# EasyEDA Pro project ProPrj_AD母版_2026-01-14.epro

# Schematic Sheet1
Board Name: Sheet1; Create Date: 2025-06-05; Page Name: Sheet1; Project Name: AD母版; Schematic Name: Sheet1; Update Date: 2025-06-05
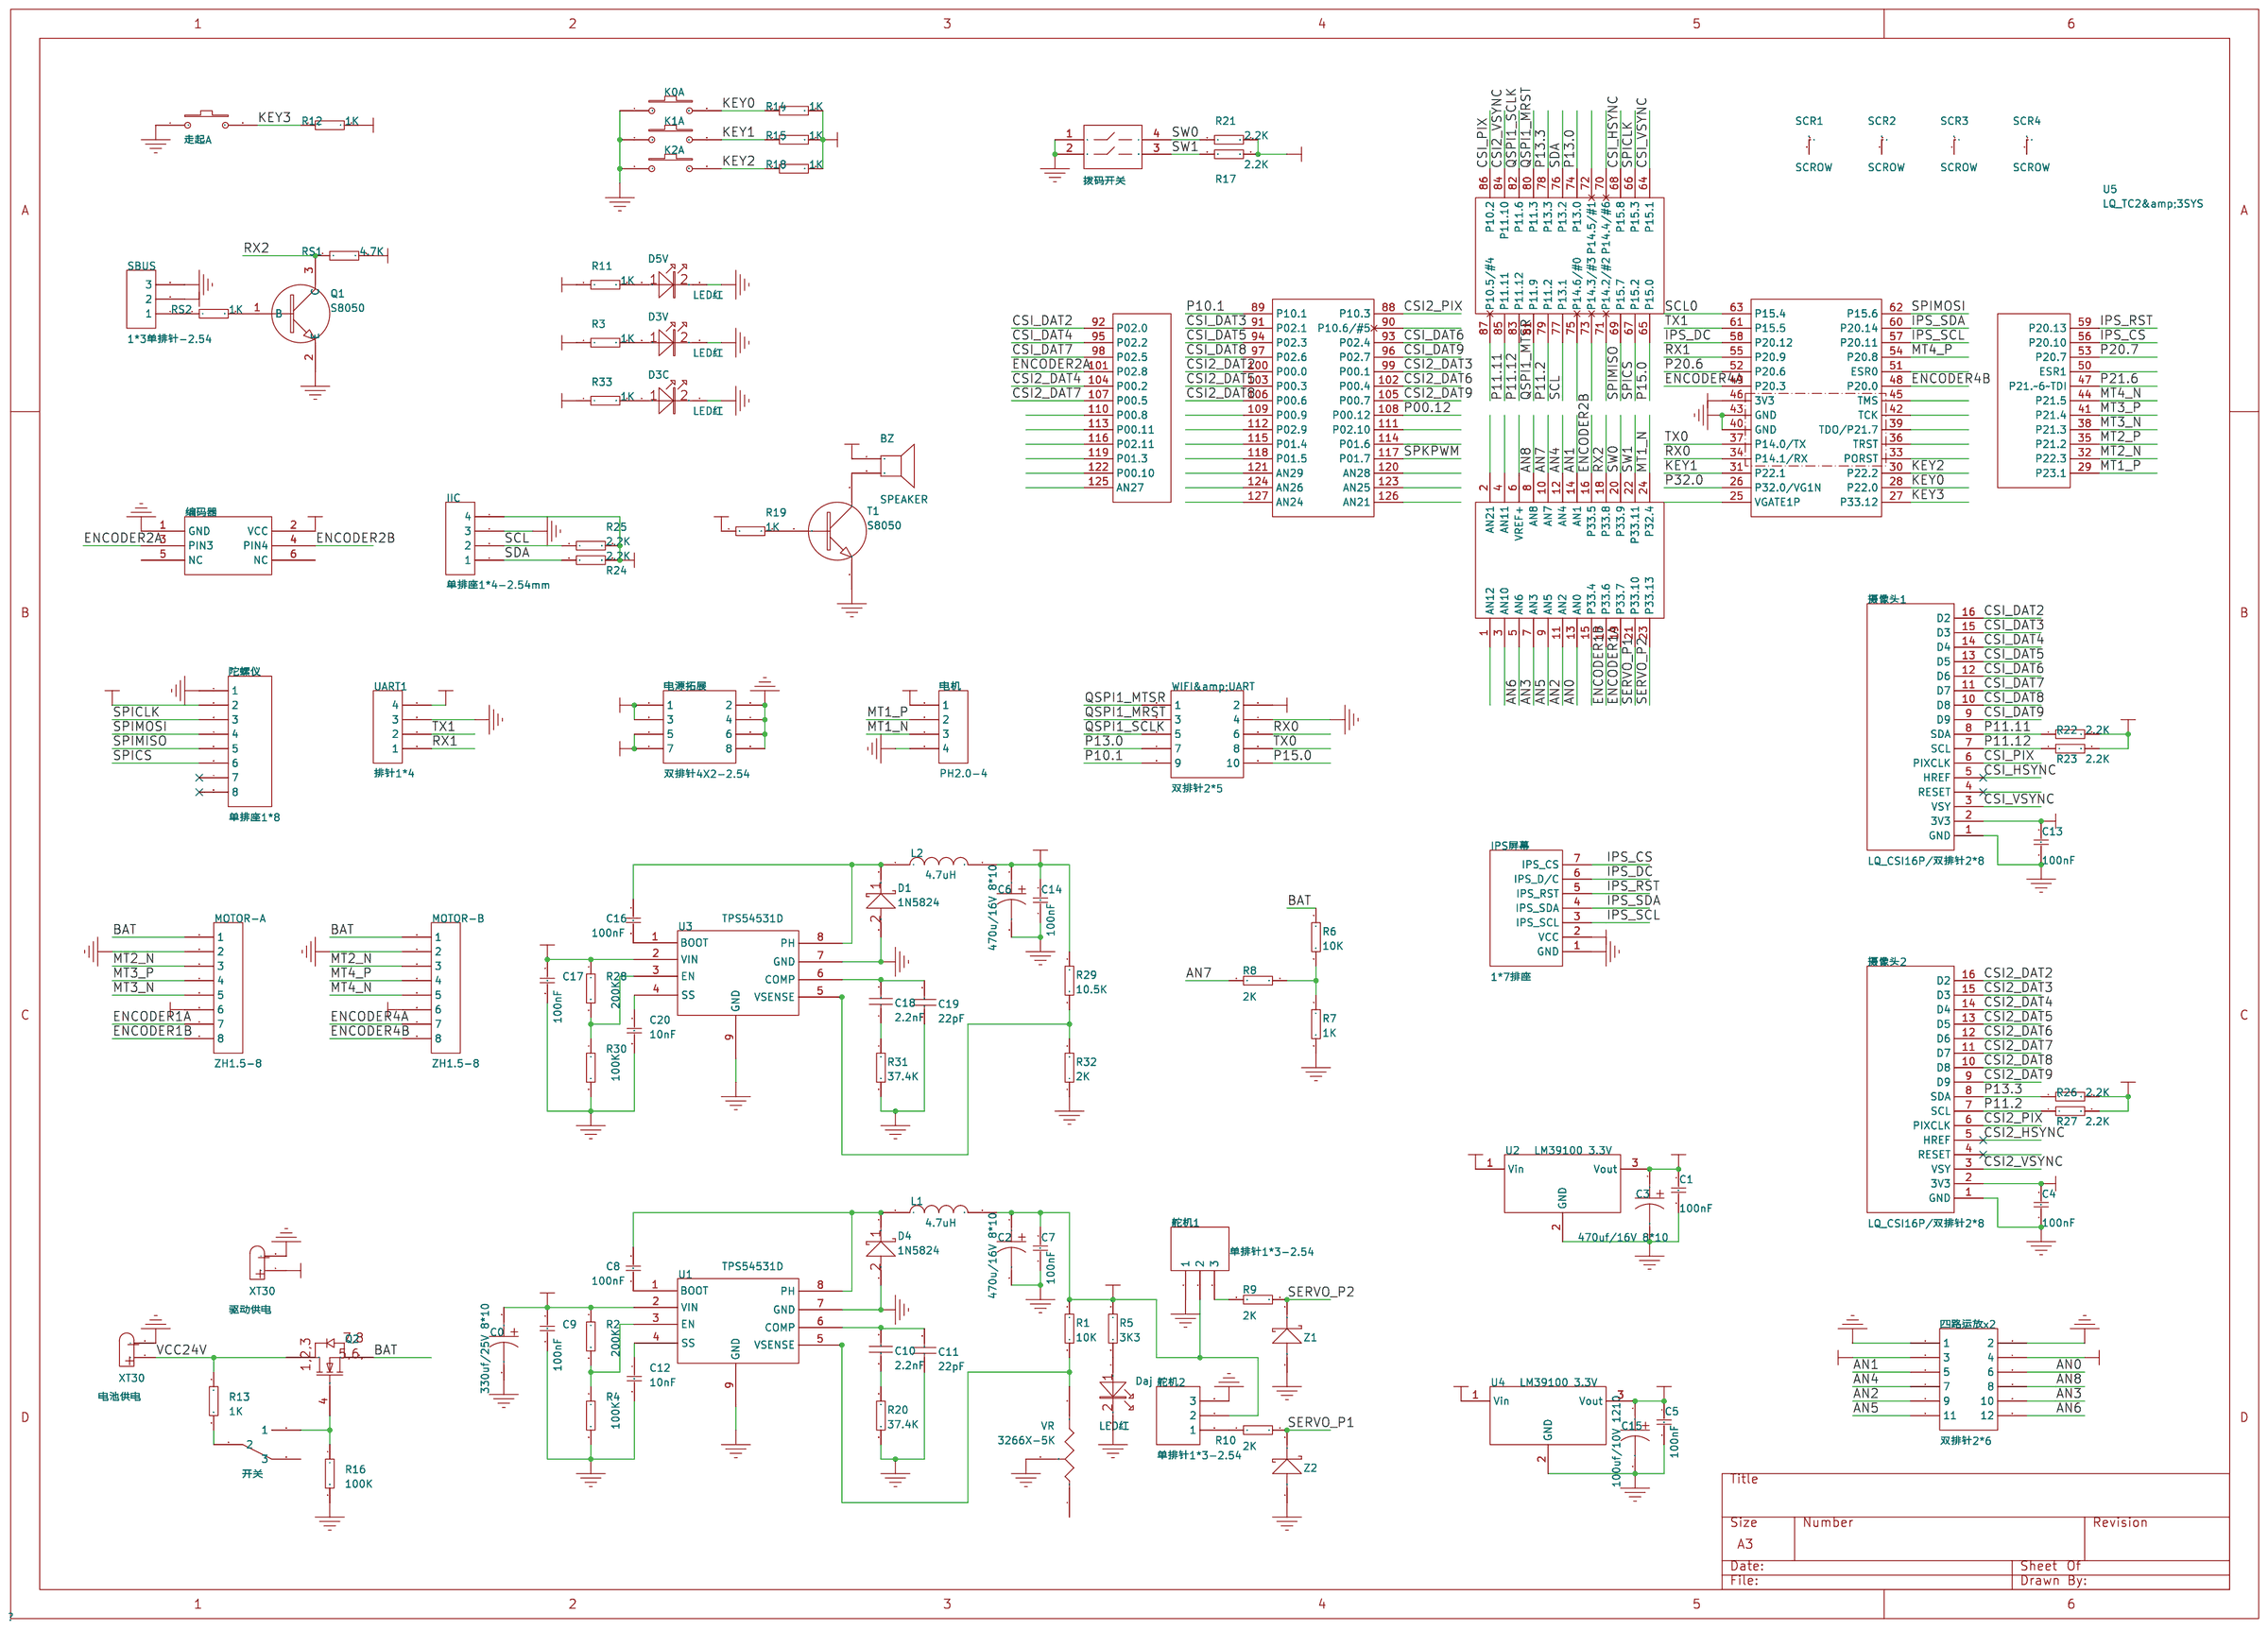
[diagram p0: schematic sheet]

## Parts
BZ  SPEAKER  [LQ_BUZZER9]
C0  330uf/25V 8*10  [LQ_C8X10]
C1  100nF  [LQ_C0603]
C2  470u/16V 8*10  [LQ_C8X10]
C3  470uf/16V 8*10  [LQ_C8X10]
C4  100nF  [LQ_C0603]
C5  100nF  [LQ_C0603]
C6  470u/16V 8*10  [LQ_C8X10]
C7  100nF  [LQ_C0603]
C8  100nF  [LQ_C0603]
C9  100nF  [LQ_C0603]
C10  2200pF  [LQ_C0603]
C11  2200pF  [LQ_C0603]
C12  10nF  [LQ_C0603]
C13  100nF  [LQ_C0603]
C14  100nF  [LQ_C0603]
C15  100uf/10V 1210  [LQ_C1210T]
C16  100nF  [LQ_C0603]
C17  100nF  [LQ_C0603]
C18  2200pF  [LQ_C0603]
C19  2200pF  [LQ_C0603]
C20  10nF  [LQ_C0603]
D1  1N5824  [LQ_D1812Z]
D3C  LED红  [LQ_LED0603R]
D3V  LED红  [LQ_LED0603R]
D4  1N5824  [LQ_D1812Z]
D5V  LED红  [LQ_LED0603R]
Daj  LED红  [LQ_LED0603R]
IIC  单排座1*4-2.54mm  [LQ_SIP4]
IPS屏幕  1*7排座  [LQ_SIP7]
K0  微动开关6*6*6  [LQ_BT4SMT]  (section 1)
K1  微动开关6*6*6  [LQ_BT4SMT]  (section 1)
K2  微动开关6*6*6  [LQ_BT4SMT]  (section 1)
L1  4.7uH  [LQ_L7X7]
L2  4.7uH  [LQ_L7X7]
MOTOR-A  ZH1.5-8  [ZH1.5-LI-8P]
MOTOR-B  ZH1.5-8  [ZH1.5-LI-8P]
Q1  S8050  [LQ_SOT-23NPN]
Q2  60V  [TRANS_NexFET_Q5B]
R1  10K  [LQ_R0603]
R2  200K  [LQ_R0603]
R3  1K  [LQ_R0603]
R4  100K  [LQ_R0603]
R5  3K3  [LQ_R0603]
R6  10K  [LQ_R0603]
R7  1K  [LQ_R0603]
R8  2K  [LQ_R0603]
R9  2K  [LQ_R0603]
R10  2K  [LQ_R0603]
R11  1K  [LQ_R0603]
R12  1K  [LQ_R0603]
R13  1K  [LQ_R0603]
R14  1K  [LQ_R0603]
R15  1K  [LQ_R0603]
R16  100K  [LQ_R0603]
R17  2.2K  [LQ_R0603]
R18  1K  [LQ_R0603]
R19  1K  [LQ_R0603]
R20  37.4K  [LQ_R0603]
R21  2.2K  [LQ_R0603]
R22  2.2K  [LQ_R0603]
R23  2.2K  [LQ_R0603]
R24  2.2K  [LQ_R0603]
R25  2.2K  [LQ_R0603]
R26  2.2K  [LQ_R0603]
R27  2.2K  [LQ_R0603]
R28  200K  [LQ_R0603]
R29  10.5K  [LQ_R0603]
R30  100K  [LQ_R0603]
R31  37.4K  [LQ_R0603]
R32  2K  [LQ_R0603]
R33  1K  [LQ_R0603]
RS1  4.7K  [LQ_R0603]
RS2  1K  [LQ_R0603]
SBUS  1*3单排针-2.54  [LQ_SIP3]
SCR1  SCROW  [LQ_SCROW3&5mm-N]
SCR2  SCROW  [LQ_SCROW3&5mm-N]
SCR3  SCROW  [LQ_SCROW3&5mm-N]
SCR4  SCROW  [LQ_SCROW3&5mm-N]
T1  S8050  [LQ_SOT-23NPN]
U1  TPS54531D  [LQ_SOP8S-p]
U2  LM39100 3.3V  [LQ_SOT-223]
U3  TPS54531D  [LQ_SOP8S-p]
U4  LM39100 3.3V  [LQ_SOT-223]
U5  LQ_TC2&amp;3SYS  [LQ_TC2&3SYS]
UART1  排针1*4  [LQ_SIP4]
VR  3266X-5K  [lq_3266]
WIFI&amp;UART  双排针2*5  [HDR2X5]
Z1  ZMM3V3  [LQ_D0805Z]
Z2  ZMM3V3  [LQ_D0805Z]
四路运放x2  双排针2*6  [HDR2X6]
开关  SS12D10  [LQ_SS12D10]
拨码开关  SW-DIP2  [DIP4]
摄像头1  LQ_CSI16P/双排针2*8  [LQ_IDC8X2]
摄像头2  LQ_CSI16P/双排针2*8  [LQ_IDC8X2]
电机  PH2.0-4  [LQ_SIP4]
电池供电  XT30  [LQ_XT30UPB-F]
电源拓展  双排针4X2-2.54  [LQ_IDC4X2]
编码器  双排针3X2  [LQ_ENCODER]
舵机1  单排针1*3-2.54  [LQ_SIP3]
舵机2  单排针1*3-2.54  [LQ_SIP3]
走起  微动开关6*6*6  [LQ_BT4SMT]  (section 1)
陀螺仪  单排座1*8  [LQ_IMU]
驱动供电  XT30  [LQ_XT30UPB-F]

## Library data of the parts
BZ = SPEAKER: Library Name: LQ-TCsUnicycleMBV2
C0 = 330uf/25V 8*10: Capacitor; Origin Footprint 2: LQ_C10X10; Design Item ID: CAPACITOR POL; Library Name: LQ-TCsUnicycleMBV2
C1 C4 C5 C7-C9 C13 C14 C16 C17 = 100nF: CAP; Origin Footprint 2: LQ_0805; Origin Footprint 3: LQ_0603; Origin Footprint 4: LQ_1206; Origin Footprint 5: LQ_1210; Design Item ID: LQ_CAP; Library Name: LQ-TCsUnicycleMBV2
C2 C6 = 470u/16V 8*10: Capacitor; Origin Footprint 2: LQ_C10X10; Design Item ID: CAPACITOR POL; Library Name: LQ-TCsUnicycleMBV2
C3 = 470uf/16V 8*10: Capacitor; Origin Footprint 2: LQ_C10X10; Design Item ID: CAPACITOR POL; Library Name: LQ-TCsUnicycleMBV2
C10 C18 = 2.2nF: Capacitor; Published: 8-Jun-2000; LatestRevisionDate: 17-Jul-2002; LatestRevisionNote: Re-released for DXP Platform.; PackageReference: RAD-0.3; Publisher: Altium Limited; PackageDescription: Radial Cap, Thru-Hole; 2 Leads; 0.3 in Pin Spacing; Origin Footprint 2: RAD-0.3; Origin Footprint 3: LQ_0603; Origin Footprint 4: 0603; Design Item ID: Cap; Library Name: LQ-TCsUnicycleMBV2
C11 C19 = 22pF: Capacitor; Published: 8-Jun-2000; LatestRevisionDate: 17-Jul-2002; LatestRevisionNote: Re-released for DXP Platform.; PackageReference: RAD-0.3; Publisher: Altium Limited; PackageDescription: Radial Cap, Thru-Hole; 2 Leads; 0.3 in Pin Spacing; Origin Footprint 2: RAD-0.3; Origin Footprint 3: LQ_0603; Origin Footprint 4: 0603; Design Item ID: Cap; Library Name: LQ-TCsUnicycleMBV2
C12 C20 = 10nF: CAP; Origin Footprint 2: LQ_0805; Origin Footprint 3: LQ_0603; Origin Footprint 4: LQ_1206; Origin Footprint 5: LQ_1210; Design Item ID: LQ_CAP; Library Name: LQ-TCsUnicycleMBV2
C15 = 100uf/10V 1210: Capacitor; Origin Footprint 2: LQ_C10X10; Design Item ID: CAPACITOR POL; Library Name: LQ-TCsUnicycleMBV2
D1 D4 = 1N5824: Schottky Diode; Origin Footprint 2: LQ_D1206Z; Origin Footprint 3: LQ_1210D; Origin Footprint 4: LQ_SOD-523; Design Item ID: LQ_Z; Library Name: LQ-TCsUnicycleMBV2
D3C D3V D5V Daj = LED红: Origin Footprint 2: LQ_LED0603RN; Origin Footprint 3: D1812; Design Item ID: LQ_LED; Library Name: LQ-TCsUnicycleMBV2
IIC = 单排座1*4-2.54mm: Connector; Design Item ID: CON4; Library Name: LQ-TCsUnicycleMBV2
IPS屏幕 = 1*7排座: Design Item ID: LQ_IPS; Library Name: LQ-TCsUnicycleMBV2
K0-K2 走起 = 微动开关6*6*6: Design Item ID: 微动开关; Library Name: LQ-TCsUnicycleMBV2
L1 L2 = 4.7uH: Design Item ID: INDUCTOR; Library Name: LQ-TCsUnicycleMBV2
MOTOR-A MOTOR-B = ZH1.5-8: Connector; Design Item ID: CON8; Library Name: LQ-TCsUnicycleMBV2
Q1 = S8050: NPN Transistor; Design Item ID: LQ_NPN; Library Name: LQ-TCsUnicycleMBV2
Q2 = AGM30P110A: 1个P沟道 耐压:30V 电流:138A，PDFN-8(5x6)。; SymbolVersion: 2008-07-09; CompType: MOSFET; PartNumber: CSD18532Q5B; Manufacturer: Texas Instruments; PackageReference: SON 5x6mm; U/M: EA; ChType: N; VdsMax_V: 60; Value1: 3.3 ohm; Rdson45_Ohm: 3.3; Value2: 27 nC; QgTyp_nC: 27; Vgs_V: 1.6; IdsMax_A: 172; RoHS: Y; MountType: SMT; Published: 2008-06-19; Publisher: Texas Instruments; LatestRevisionDate: 2014-05-23; LatestRevisionNote: Added parts.; ComponentLink1Description: Datasheet link; ComponentLink1URL: http://www.ti.com/lit/gpn/csd18532q5b; Alternate Manufacturer: None; Supplier 1: Digi-Key; Supplier Part Number 1: 296-35628-1-ND; Supplier 2: Mouser; Supplier Part Number 2: 595-CSD18532Q5B; Supplier 3: Newark; Supplier Part Number 3: 63W5308; Design Item ID: LQ_PMOS-DFN5X6; Library Name: LQ-TCsUnicycleMBV2
R1 R6 = 10K: RES; Origin Footprint 2: LQ_0805; Origin Footprint 3: 0603; Design Item ID: LQ_RES; Library Name: LQ-TCsUnicycleMBV2
R2 R28 = 200K: RES; Origin Footprint 2: LQ_0805; Origin Footprint 3: 0603; Design Item ID: LQ_RES; Library Name: LQ-TCsUnicycleMBV2
R3 R7 R11-R15 R18 R19 R33 RS2 = 1K: RES; Origin Footprint 2: LQ_0805; Origin Footprint 3: 0603; Design Item ID: LQ_RES; Library Name: LQ-TCsUnicycleMBV2
R4 R16 R30 = 100K: RES; Origin Footprint 2: LQ_0805; Origin Footprint 3: 0603; Design Item ID: LQ_RES; Library Name: LQ-TCsUnicycleMBV2
R5 = 3K3: RES; Origin Footprint 2: LQ_0805; Origin Footprint 3: 0603; Design Item ID: LQ_RES; Library Name: LQ-TCsUnicycleMBV2
R8-R10 R32 = 2K: RES; Origin Footprint 2: LQ_0805; Origin Footprint 3: 0603; Design Item ID: LQ_RES; Library Name: LQ-TCsUnicycleMBV2
R17 R21-R27 = 2.2K: RES; Origin Footprint 2: LQ_0805; Origin Footprint 3: 0603; Design Item ID: LQ_RES; Library Name: LQ-TCsUnicycleMBV2
R20 R31 = 37.4K: RES; Origin Footprint 2: LQ_0805; Origin Footprint 3: 0603; Design Item ID: LQ_RES; Library Name: LQ-TCsUnicycleMBV2
R29 = 10.5K: RES; Origin Footprint 2: LQ_0805; Origin Footprint 3: 0603; Design Item ID: LQ_RES; Library Name: LQ-TCsUnicycleMBV2
RS1 = 4.7K: RES; Origin Footprint 2: LQ_0805; Origin Footprint 3: 0603; Design Item ID: LQ_RES; Library Name: LQ-TCsUnicycleMBV2
SBUS = 1*3单排针-2.54: Connector; Design Item ID: CON3; Library Name: LQ-TCsUnicycleMBV2
SCR1-SCR4 = SCROW: Connector; Origin Footprint 2: LQ_SCROW3&amp;5mm; Origin Footprint 3: LQ_SCROW2&amp;3mm; Origin Footprint 1: LQ_SCROW3&amp;5mm-N; Library Name: LQ-TCsUnicycleMBV2
T1 = S8050: NPN Transistor; Design Item ID: NPN; Library Name: LQ-TCsUnicycleMBV2
U1 U3 = TPS54531D: Origin Footprint 2: SOP8; Origin Footprint 3: 54531; Origin Footprint 4: 54531; Design Item ID: 54531; Library Name: LQ-TCsUnicycleMBV2
U2 U4 = LM39100 3.3V: Origin Footprint 2: LQ_TO-263-3; Design Item ID: VOLTREG; Library Name: LQ-TCsUnicycleMBV2
U5 = LQ_TC2&3SYS: Library Name: LQ-TCsUnicycleMBV2
UART1 = 排针1*4: Connector; Design Item ID: CON4; Library Name: LQ-TCsUnicycleMBV2
VR = 3266X-5K: Origin Footprint 2: LQ_VR5; Design Item ID: RESISTOR TAPPED; Library Name: LQ-TCsUnicycleMBV2
WIFI&amp;UART = 双排针2*5: Design Item ID: HEADER 5X2; Library Name: LQ-TCsUnicycleMBV2
Z1 Z2 = ZMM3V3: Schottky Diode; Origin Footprint 2: LQ_1210D; Origin Footprint 3: LQ_1812D; Design Item ID: LQ_D; Library Name: LQ-TCsUnicycleMBV2
四路运放x2 = 双排针2*6: Header, 6-Pin, Dual row; LatestRevisionDate: 17-Jul-2002; LatestRevisionNote: Re-released for DXP Platform.; Publisher: Altium Limited; Design Item ID: Header 6X2; Library Name: LQ-TCsUnicycleMBV2
开关 = SS12D10: LQ_SWMTS102; Origin Footprint 2: LQ_SWMTS102; Origin Footprint 3: LQ_SWMTS102; Design Item ID: LQ_SWMTS102; Library Name: LQ-TCsUnicycleMBV2
拨码开关 = SW-DIP2: Library Name: LQ-TCsUnicycleMBV2
摄像头1 摄像头2 = LQ_CSI16P/双排针2*8: LQ_CSI16P; Origin Footprint 2: LQ_FPC0MM5-16P; Design Item ID: LQ_CSI16P; Library Name: LQ-TCsUnicycleMBV2
电机 = PH2.0-4: Connector; Design Item ID: CON4; Library Name: LQ-TCsUnicycleMBV2
电池供电 驱动供电 = XT30: Jumper; Origin Footprint 2: LQ_XT30UPB-M; Origin Footprint 3: LQ_XT30PW-M; Origin Footprint 4: LQ_XT30PW-F; Design Item ID: LQ_XT30; Library Name: LQ-TCsUnicycleMBV2
电源拓展 = 双排针4X2-2.54: Design Item ID: Header 4X2; Library Name: LQ-TCsUnicycleMBV2
编码器 = 双排针3X2: Design Item ID: Component_1_1; Library Name: LQ-TCsUnicycleMBV2
舵机1 舵机2 = 单排针1*3-2.54: Design Item ID: HEADER 3; Library Name: LQ-TCsUnicycleMBV2
陀螺仪 = 单排座1*8: 8 Pin Header; Design Item ID: 8 HEADER; Library Name: LQ-TCsUnicycleMBV2

## Nets
5V: C6.1 C14.1 L2.2 R11.1 R29.1 SBUS.2 U2.1(Vin) U4.1(Vin) UART1.4 WIFI&amp;UART.2 电源拓展.5 电源拓展.7
GND: C0.2 C1.2 C2.2 C3.2 C4.2 C5.2 C6.2 C7.2 C9.2 C11.1 C12.2 C13.2 C14.2 C15.2 C17.2 C19.1 C20.2 D1.2 D3C.2 D3V.2 D4.2 D5V.2 Daj.2 IIC.3 IPS屏幕.1(GND) K0.1 K1.1 K2.1 MOTOR-A.2 MOTOR-B.2 Q1.2(E) R4.2 R7.2 R16.2 R20.2 R30.2 R31.2 R32.1 SBUS.3 T1.3(E) U1.7(GND) U1.9(GND) U2.2(GND) U3.7(GND) U3.9(GND) U4.2(GND) U5.40(GND) U5.43(GND) UART1.3 VR.3(TAP) WIFI&amp;UART.4 Z1.2 Z2.2 四路运放x2.1 四路运放x2.2 拨码开关.1 拨码开关.2 摄像头1.1(GND) 摄像头2.1(GND) 电机.4 电池供电.2(-) 电源拓展.2 电源拓展.4 电源拓展.6 电源拓展.8 编码器.1(GND) 舵机1.1 舵机2.3 走起.1 陀螺仪.1 驱动供电.2(-)
V3.3: BZ.1 C1.1 C3.1 IIC.4 IPS屏幕.2(VCC) MOTOR-A.6 MOTOR-B.6 R3.1 R12.2 R14.2 R15.2 R17.2 R18.2 R21.2 R22.2 R23.2 R24.2 R25.2 R26.2 R27.2 RS1.2 U2.3(Vout) U5.46(3V3) 四路运放x2.3 四路运放x2.4 电机.1 电源拓展.1 电源拓展.3 编码器.2(VCC) 陀螺仪.2
V3.3C: C4.1 C5.1 C13.1 C15.1 R33.1 U4.3(Vout) 摄像头1.2(3V3) 摄像头2.2(3V3)
VCC24V: Q2.1(S) Q2.2(S) Q2.3(S) R13.1 电池供电.1(+)
AN0: U5.13(AN0) 四路运放x2.6
AN1: U5.14(AN1) 四路运放x2.5
AN2: U5.11(AN2) 四路运放x2.9
AN3: U5.7(AN3) 四路运放x2.10
AN4: U5.12(AN4) 四路运放x2.7
AN5: U5.9(AN5) 四路运放x2.11
AN6: U5.5(AN6) 四路运放x2.12
AN7: R8.1 U5.10(AN7)
AN8: U5.8(AN8) 四路运放x2.8
BAT: C0.1 C9.1 C17.1 MOTOR-A.1 MOTOR-B.1 Q2.5(D) Q2.6(D) Q2.7(D) Q2.8(D) R2.1 R6.1 R28.1 U1.2(VIN) U3.2(VIN) 驱动供电.1(+)
CSI2_DAT2: U5.100(P00.0) 摄像头2.16(D2)
CSI2_DAT3: U5.99(P00.1) 摄像头2.15(D3)
CSI2_DAT4: U5.104(P00.2) 摄像头2.14(D4)
CSI2_DAT5: U5.103(P00.3) 摄像头2.13(D5)
CSI2_DAT6: U5.102(P00.4) 摄像头2.12(D6)
CSI2_DAT7: U5.107(P00.5) 摄像头2.11(D7)
CSI2_DAT8: U5.106(P00.6) 摄像头2.10(D8)
CSI2_DAT9: U5.105(P00.7) 摄像头2.9(D9)
CSI2_HSYNC: 摄像头2.5(HREF)
CSI2_PIX: U5.88(P10.3) 摄像头2.6(PIXCLK)
CSI2_VSYNC: U5.84(P11.10) 摄像头2.3(VSY)
CSI_DAT2: U5.92(P02.0) 摄像头1.16(D2)
CSI_DAT3: U5.91(P02.1) 摄像头1.15(D3)
CSI_DAT4: U5.95(P02.2) 摄像头1.14(D4)
CSI_DAT5: U5.94(P02.3) 摄像头1.13(D5)
CSI_DAT6: U5.93(P02.4) 摄像头1.12(D6)
CSI_DAT7: U5.98(P02.5) 摄像头1.11(D7)
CSI_DAT8: U5.97(P02.6) 摄像头1.10(D8)
CSI_DAT9: U5.96(P02.7) 摄像头1.9(D9)
CSI_HSYNC: U5.68(P15.8) 摄像头1.5(HREF)
CSI_PIX: U5.86(P10.2) 摄像头1.6(PIXCLK)
CSI_VSYNC: U5.64(P15.1) 摄像头1.3(VSY)
ENCODER1A: MOTOR-A.7 U5.19(P33.7)
ENCODER1B: MOTOR-A.8 U5.17(P33.6)
ENCODER2A: U5.101(P02.8) 编码器.3(PIN3)
ENCODER2B: U5.16(P33.5) 编码器.4(PIN4)
ENCODER4A: MOTOR-B.7 U5.49(P20.3)
ENCODER4B: MOTOR-B.8 U5.48(P20.0)
IPS_CS: IPS屏幕.7(IPS_CS) U5.56(P20.10)
IPS_DC: IPS屏幕.6(IPS_D/C) U5.58(P20.12)
IPS_RST: IPS屏幕.5(IPS_RST) U5.59(P20.13)
IPS_SCL: IPS屏幕.3(IPS_SCL) U5.57(P20.11)
IPS_SDA: IPS屏幕.4(IPS_SDA) U5.60(P20.14)
KEY0: K0.2 R14.1 U5.28(P22.0)
KEY1: K1.2 R15.1 U5.31(P22.1)
KEY2: K2.2 R18.1 U5.30(P22.2)
KEY3: R12.1 U5.27(P33.12) 走起.2
MT1_N: U5.24(P32.4) 电机.3
MT1_P: U5.29(P23.1) 电机.2
MT2_N: MOTOR-A.3 MOTOR-B.3 U5.32(P22.3)
MT2_P: U5.35(P21.2)
MT3_N: MOTOR-A.5 U5.38(P21.3)
MT3_P: MOTOR-A.4 U5.41(P21.4)
MT4_N: MOTOR-B.5 U5.44(P21.5)
MT4_P: MOTOR-B.4 U5.54(P20.8)
P00.12: U5.108(P00.12)
P10.1: U5.89(P10.1) WIFI&amp;UART.9
P11.2: R27.1 U5.79(P11.2) 摄像头2.7(SCL)
P11.11: R22.1 U5.85(P11.11) 摄像头1.8(SDA)
P11.12: R23.1 U5.83(P11.12) 摄像头1.7(SCL)
P13.0: U5.74(P13.0) WIFI&amp;UART.7
P13.3: R26.1 U5.78(P13.3) 摄像头2.8(SDA)
P15.0: U5.65(P15.0) WIFI&amp;UART.10
P20.6: U5.52(P20.6)
P20.7: U5.53(P20.7)
P21.6: U5.47(P21.~6~TDI)
P32.0: U5.26(P32.0/VG1N)
QSPI1_MRST: U5.80(P11.3) WIFI&amp;UART.3
QSPI1_MTSR: U5.81(P11.9) WIFI&amp;UART.1
QSPI1_SCLK: U5.82(P11.6) WIFI&amp;UART.5
RX0: U5.34(P14.1/RX) WIFI&amp;UART.6
RX1: U5.55(P20.9) UART1.1
RX2: Q1.3(C) RS1.1 U5.18(P33.8)
SCL: IIC.2 R25.1 U5.77(P13.1)
SCL0: U5.63(P15.4)
SDA: IIC.1 R24.1 U5.76(P13.2)
SERVO_P1: R10.2 U5.21(P33.10) Z2.1
SERVO_P2: R9.2 U5.23(P33.13) Z1.1
SPICLK: U5.66(P15.3) 陀螺仪.3
SPICS: U5.67(P15.2) 陀螺仪.6
SPIMISO: U5.69(P15.7) 陀螺仪.5
SPIMOSI: U5.62(P15.6) 陀螺仪.4
SPKPWM: R19.1 U5.117(P01.7)
SW0: R21.1 U5.20(P33.9) 拨码开关.4
SW1: R17.1 U5.22(P33.11) 拨码开关.3
TX0: U5.37(P14.0/TX) WIFI&amp;UART.8
TX1: U5.61(P15.5) UART1.2
VADJ: C2.1 C7.1 L1.2 R1.1 R5.1 舵机1.2 舵机2.2
$1N172: C8.1 D4.1 L1.1 U1.8(PH)
$1N175: R1.2 U1.5(VSENSE) VR.2(B)
$1N177: C10.2 C11.2 U1.6(COMP)
$1N178: C10.1 R20.1
$1N182: C12.1 U1.4(SS)
$1N183: R2.2 R4.1 U1.3(EN)
$1N186: Q2.4(G) R16.1 开关.1
$1N188: R13.2 开关.2
$1N189: R9.1 舵机1.3
$1N196: C16.1 D1.1 L2.1 U3.8(PH)
$1N199: R29.2 R32.2 U3.5(VSENSE)
$1N201: C18.2 C19.2 U3.6(COMP)
$1N202: C18.1 R31.1
$1N206: C20.1 U3.4(SS)
$1N207: R28.2 R30.1 U3.3(EN)
$1N209: R6.2 R7.1 R8.2
$1N2218: C8.2 U1.1(BOOT)
$1N2219: Daj.1 R5.2
$1N2234: R10.1 舵机2.1
$1N2243: C16.2 U3.1(BOOT)
$1N2252: R19.2 T1.1(B)
$1N2253: BZ.2 T1.2(C)
$1N2260: D5V.1 R11.2
$1N2261: D3V.1 R3.2
$1N2262: D3C.1 R33.2
$1N2277: RS2.1 SBUS.1
$1N2278: Q1.1(B) RS2.2

Not connected (* = marked no-connect by the designer): SCR1 1; SCR2 1; SCR3 1; SCR4 1; U5 1(AN12) 2(AN21) 3(AN10) 4(AN11) 6(VREF+) 15(P33.4) 25(VGATE1P) 33(PORST) 36(TRST) 39(TDO/P21.7) 42(TCK) 45(TMS) 50(ESR1) 51(ESR0) 70(P14.4/#6) 71(P14.2/#2) 72(P14.5/#1) 73(P14.3/#3) 75(P14.6/#0) 87(P10.5/#4) 90(P10.6/#5) 109(P00.9) 110(P00.8) 111(P02.10) 112(P02.9) 113(P00.11) 114(P01.6) 115(P01.4) 116(P02.11) 118(P01.5) 119(P01.3) 120(AN28) 121(AN29) 122(P00.10) 123(AN25) 124(AN26) 125(AN27) 126(AN21) 127(AN24); VR 1(A); 开关 3; 摄像头1 4(RESET)*; 摄像头2 4(RESET)*; 编码器 5(NC) 6(NC); 陀螺仪 7* 8*
